# EAGLE schematic 15C_PCB_v4 (EAGLE 9.7.0)
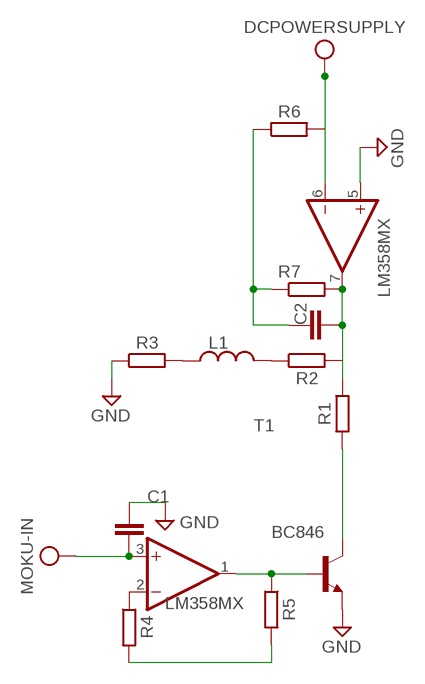
[diagram p0: schematic, sheet 1]

## Parts
C1  C_RADIAL-55.5MM-DIA  [CAPRD2261W240D5080H5555B]
C2  C_RADIAL-55.5MM-DIA  [CAPRD2261W240D5080H5555B]
IC1  LM358MX  [SO08]
L1  L_RADIAL-26MM-DIA  [INDRD2743W50D3810H2616B]
R1  R_AXIAL-7.2MM-PITCH  [RESAD724W46L381D178B]
R2  R_AXIAL-7.2MM-PITCH  [RESAD724W46L381D178B]
R3  R_AXIAL-7.2MM-PITCH  [RESAD724W46L381D178B]
R4  R_AXIAL-7.2MM-PITCH  [RESAD724W46L381D178B]
R5  R_AXIAL-7.2MM-PITCH  [RESAD724W46L381D178B]
R6  R_AXIAL-7.2MM-PITCH  [RESAD724W46L381D178B]
R7  R_AXIAL-7.2MM-PITCH  [RESAD724W46L381D178B]
T1  BC846  [SOT23]

## Nets
DCPOWERSUPPLY: IC1.6(B:-IN) R6.2
GND: C1.1 IC1.5(B:+IN) R3.1 T1.2(E)
MOKU-IN: C1.2 IC1.3(A:+IN)
N$1: R1.1 T1.3(C)
N$2: C2.1 R6.1 R7.1
N$3: L1.2 R2.1
N$4: L1.1 R3.2
N$5: IC1.1(A:OUT) R5.1 T1.1(B)
N$6: IC1.2(A:-IN) R4.1
N$7: R4.2 R5.2
N$9: C2.2 IC1.7(B:OUT) R1.2 R2.2 R7.2

## Power pins joined to a net without a drawn wire
V+: IC1.8(P:V+)
V-: IC1.4(P:V-)

## Library data of the parts
C1 C2 = Capacitor:C: Capacitor - Generic; CATEGORY: Capacitor
IC1 = linear:LM358: OP AMP also LM158; LM258; LM2904 Source: http://cache.national.com/ds/LM/LM158.pdf
L1 = Inductor:L: Inductor Fixed - Generic; CATEGORY: Inductor; SUB-CATEGORY: Fixed
R1-R7 = Resistor:R: Resistor Fixed - Generic; CATEGORY: Resistor; SUB-CATEGORY: Fixed
T1 = transistor:BC846: NPN TRANSISTOR